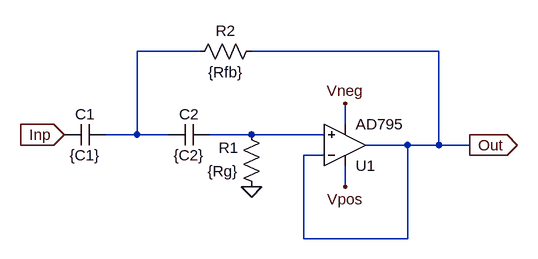
[diagram p0: schematic Draft3.asc]
Draft3.asc, the LTspice schematic file:
Version 4
SHEET 1 880 680
WIRE 96 224 0 224
WIRE 464 224 176 224
WIRE 320 336 320 304
WIRE 0 352 0 224
WIRE 0 352 -48 352
WIRE 48 352 0 352
WIRE 176 352 112 352
WIRE 288 352 176 352
WIRE 416 368 352 368
WIRE 464 368 464 224
WIRE 464 368 416 368
WIRE 512 368 464 368
WIRE 288 384 256 384
WIRE 320 432 320 400
WIRE 256 512 256 384
WIRE 416 512 416 368
WIRE 416 512 256 512
FLAG 176 432 0
FLAG 320 304 Vneg
FLAG 320 432 Vpos
FLAG -112 352 Inp
IOPIN -112 352 In
FLAG 512 368 Out
IOPIN 512 368 Out
SYMBOL OpAmps\\AD795 320 432 M180
SYMATTR InstName U1
SYMBOL res 192 448 R180
WINDOW 0 36 76 Left 2
WINDOW 3 36 40 Left 2
SYMATTR InstName R1
SYMATTR Value {Rg}
SYMBOL res 80 240 R270
WINDOW 0 32 56 VTop 2
WINDOW 3 0 56 VBottom 2
SYMATTR InstName R2
SYMATTR Value {Rfb}
SYMBOL cap -48 336 R90
WINDOW 0 0 32 VBottom 2
WINDOW 3 32 32 VTop 2
SYMATTR InstName C1
SYMATTR Value {C1}
SYMBOL cap 112 336 R90
WINDOW 0 0 32 VBottom 2
WINDOW 3 32 32 VTop 2
SYMATTR InstName C2
SYMATTR Value {C2}

The netlist it stands for:
* Draft3.asc
XU1 N002 Out Vpos Vneg Out AD795  ; pins In+ In- V+ V- OUT
R1 0 N002 {Rg}
R2 N001 Out {Rfb}
C1 N001 Inp {C1}
C2 N002 N001 {C2}
.lib ADI1.lib
.backanno
.end